# Altium schematic sheet BoardC.SchDoc
size A; SheetNumber: 9; SheetTotal: 9
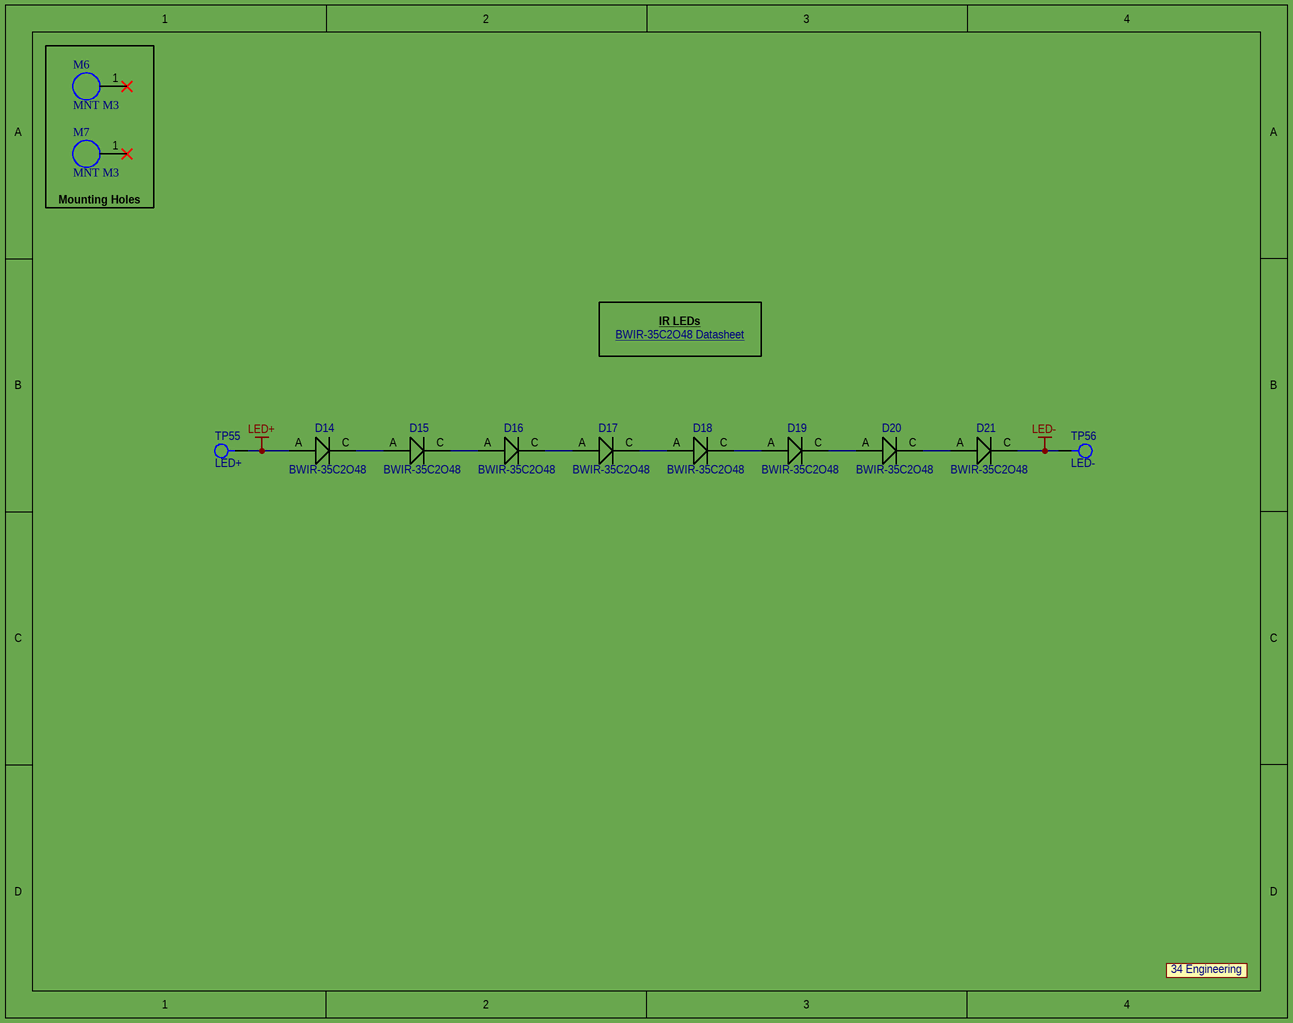
[diagram p0: BoardC.SchDoc]

## Parts
D14  BWIR-35C2O48  [BWIR-35C2O48]
D15  BWIR-35C2O48  [BWIR-35C2O48]
D16  BWIR-35C2O48  [BWIR-35C2O48]
D17  BWIR-35C2O48  [BWIR-35C2O48]
D18  BWIR-35C2O48  [BWIR-35C2O48]
D19  BWIR-35C2O48  [BWIR-35C2O48]
D20  BWIR-35C2O48  [BWIR-35C2O48]
D21  BWIR-35C2O48  [BWIR-35C2O48]
LOGO2  34 Engineering Logo  [34EngineeringLogo]  (value not drawn)
M6  MNT M3  [MNT M3]
M7  MNT M3  [MNT M3]
TP55  LED+  [TestPoint1mm]
TP56  LED-  [TestPoint1mm]

## Blocks framed on the sheet
Mounting Holes: M6 M7

## Nets
LED+: D14.A TP55.1
LED-: D21.C TP56.1
NetD14_C: D14.C D15.A
NetD15_C: D15.C D16.A
NetD16_C: D16.C D17.A
NetD17_C: D17.C D18.A
NetD18_C: D18.C D19.A
NetD19_C: D19.C D20.A
NetD20_C: D20.C D21.A

Not connected (* = marked no-connect by the designer): M6 1*; M7 1*

## Notes on the sheet
- IR LEDs
- BWIR-35C2O48 Datasheet <https://www.americanbrightled.com/pdffiles/ir-uv/ir/BWIR-35C2O48.pdf>
- (in symbol 34EngineeringLogo) 34 Engineering

## Library data of the parts
D14-D21 = BWIR-35C2O48: Infrared (IR) Emitter 850nm 1.7V 1A 260mW/sr @ 1A (Typ) 120° 1414 (3535 Metric); Manufacturer: American Bright; Supplier 1: Digi-Key; Manufacturer Part Number: BWIR-35C2O48; RoHS: No; Stock 1: 22417; Pricing 1: 1=2.11000, 10=1.40800, 100=1.08350, 500=0.97944, 1000=0.86625 (USD); Packaging: Tape and Reel; Supplier Part Number 1: BWIR-35C2O48CT-ND
LOGO2 = 34EngineeringLogo: 34 Engineering Silkscreen Logo
M6 M7 = MNT M3: Mounting hole for an M3 bolt
TP55 TP56 = TestPoint1mm: Test Point 1mm Diameter